# EAGLE design DIGISPARK_PRODUCTION_REV3 (EAGLE 7.5.0)
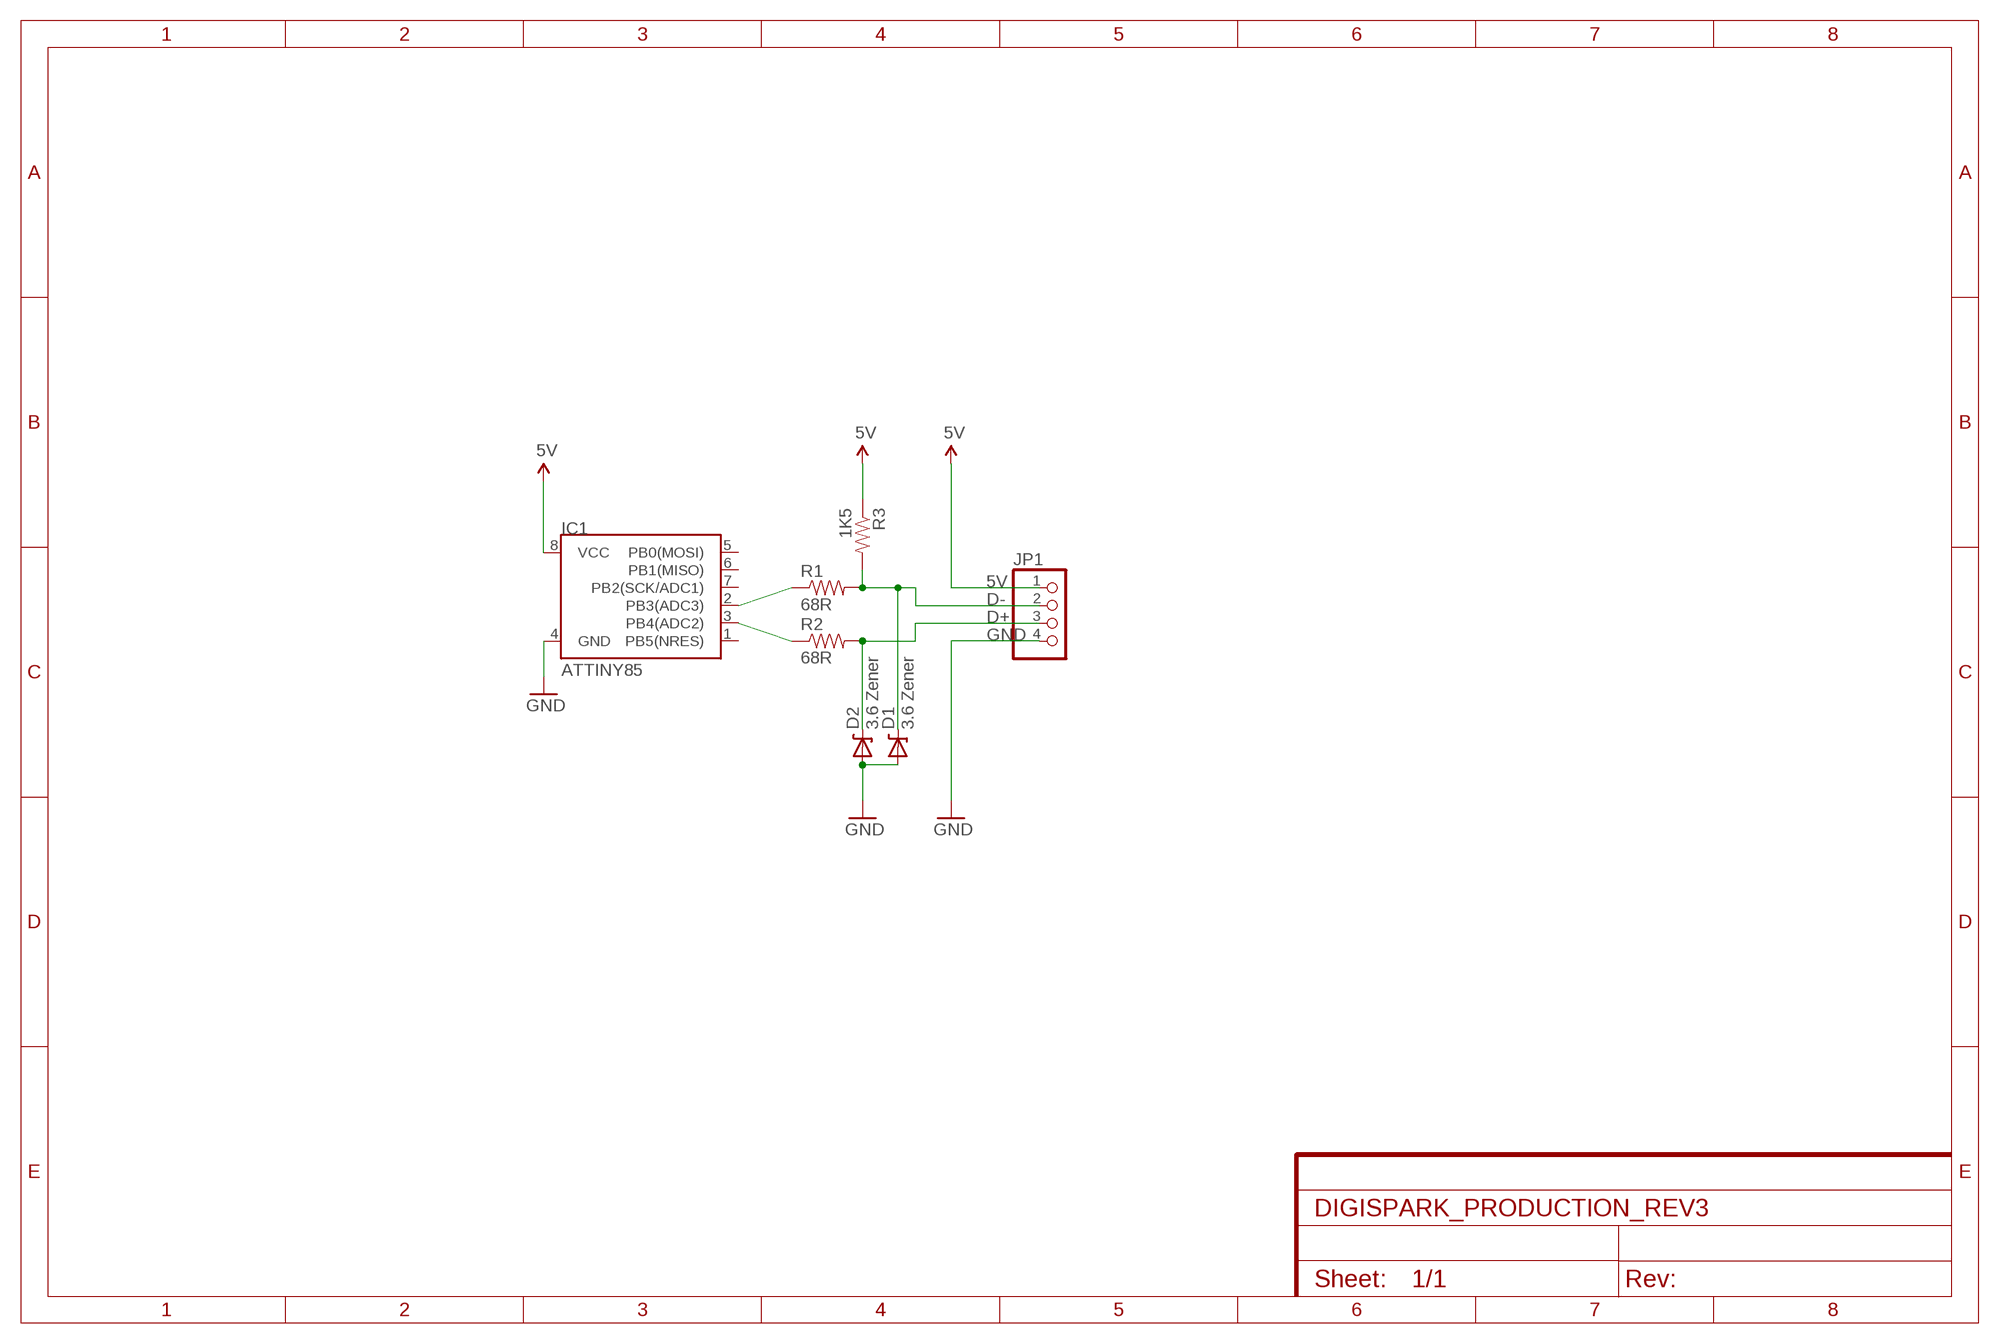
[diagram p0: schematic, sheet 1]

## Parts
D1  3.6 Zener  DIODE-ZENER-BZT52  [SOD-323]
D2  3.6 Zener  DIODE-ZENER-BZT52  [SOD-323]
IC1  ATTINY85  ATTINY45  [SO08-EIAJ]
JP1  PINHD-1X4  [1X04]
R1  68R  RESISTOR0402-RES  [0402-RES]
R2  68R  RESISTOR0402-RES  [0402-RES]
R3  1K5  RESISTOR0402-RES  [0402-RES]

## Nets
5V: IC1.8(VCC) JP1.1 R3.1
D+: D2.1(C) JP1.3 R2.2
D-: D1.1(C) JP1.2 R1.2 R3.2
GND: D1.2(A) D2.2(A) IC1.4(GND) JP1.4
N$2: IC1.2(PB3(ADC3)) R1.1
N$4: IC1.3(PB4(ADC2)) R2.1
Unconnected: IC1.1(PB5(NRES)) IC1.5(PB0(MOSI)) IC1.6(PB1(MISO)) IC1.7(PB2(SCK/ADC1))

## Library data of the parts
D1 D2 = SparkFun:DIODE-ZENER: Zener Diode Production Part - 8199 3.4V Zener Voltage
IC1 = SparkFun:ATTINY45: Atmel ATTiny45
JP1 = pinhead:PINHD-1X4: PIN HEADER
R1-R3 = SparkFun:RESISTOR: Resistor Basic schematic elements and footprints for 0603, 1206, and PTH resistors.

## Board
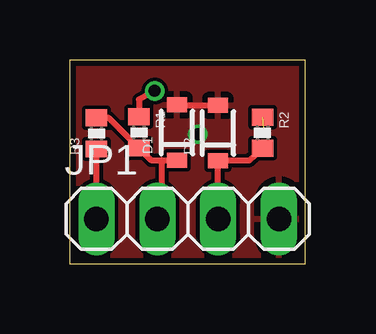
[diagram p1: board, top side]
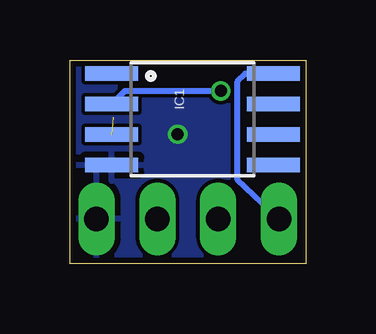
[diagram p2: board, bottom side, seen from below]

Size 9.83 x 8.49 mm. Coordinates in mm from the lower left corner, seen from the top.
Outline: 0,0 9.83,0 9.83,8.49 0,8.49 0,0
Copper layers (1*16): Top 0.035mm / dielectric 1.5mm / Bottom 0.035mm
Design rules "SeeedStudio_2layer_DRU_no_angle_20140221": minimum track width 6mil, minimum drill 12mil, track to track 6mil, track to pad 6mil, pad to pad 6mil, via to via 6mil, smd to smd 0mil, copper to edge 10mil, drill to drill 10mil, minimum pad ring 10mil, minimum via ring 6mil, stop-mask expansion 2mil, vias tented up to drill 100mil, thermal gap 10mil

### Footprints (pad centres in the part's own frame; a part is rotated, then mirrored left to right if it is on the bottom)
SOD-323 = smd 0.63 x 0.83: 1 -1.15,0; 2 1.15,0
SO08-EIAJ = smd 0.61 x 2.21: 1 -1.905,-3.378; 2 -0.635,-3.378; 3 0.635,-3.378; 4 1.905,-3.378; 5 1.905,3.353; 6 0.635,3.353; 7 -0.635,3.353; 8 -1.905,3.353
1X04 = drill 1.016 long: 1 -3.81,0; 2 -1.27,0; 3 1.27,0; 4 3.81,0
0402-RES = smd 0.7 x 0.9: 1 -0.65,0; 2 0.65,0

### Placement (x,y rotation side)
D1  4.48,5.47 90 top
D2  6.19,5.45 90 top
IC1  4.72,6.02 270 bottom
JP1  4.93,1.87 0 top
R1  2.89,5.47 270 top
R2  8.05,5.46 270 top
R3  1.12,5.43 90 top

### Tracks (layer width: path | path; a pad name or v marks a point on that pad's centre or on a via)
5V
  Top 0.254: JP1.1 R3.1
  Bottom 0.254: JP1.1 2.85,3.5 2.85,7.6 2.52,7.92 IC1.8
D+
  Top 0.254: JP1.3 D2.1 7.49,4.3 R2.2
D-
  Top 0.254: 3.85,4.32 3.39,4.32 R1.2 1.63,6.08 R3.2 | 3.85,4.32 D1.1 | JP1.2 3.85,2.06 3.85,4.32
GND  (via drill 0.5)
  Top 0.254: D1.2 4.5,6.6 D2.2 6.25,6.54 6.25,6.5
  other vias: 5.35,5.4
  pour Bottom: -0.2,8.8 10.1,8.8 10.1,-0.3 -0.2,-0.3 -0.2,8.7
  pour Top: 0,8.8 9.9,8.8 9.9,-0.3 0,-0.3
N$2  (via drill 0.5)
  Top 0.254: v3.55,7.2 2.89,6.84 R1.1
  Bottom 0.254: IC1.2 7.55,7.2 v3.55,7.2
N$4  (1 unrouted)